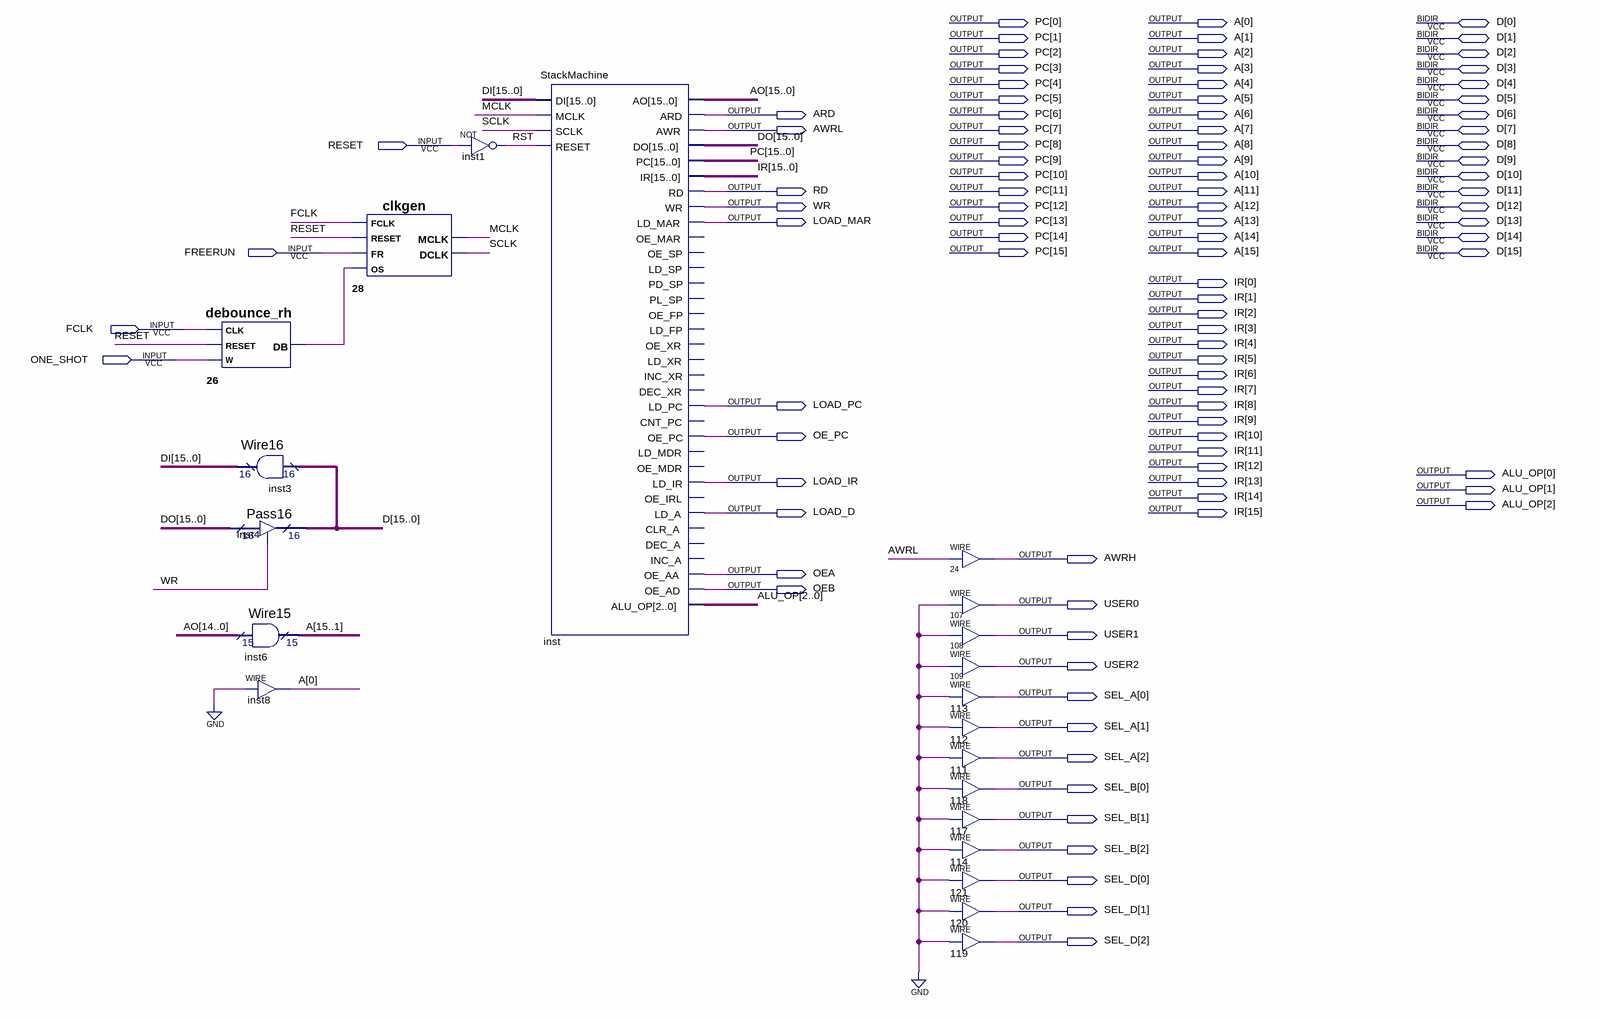
[diagram p0: schematic sheet]
// Quartus schematic StackMachine_hw.bdf as structural Verilog: 21 symbols, 95 pins
module StackMachine_hw (
  input  RESET,
  input  FREERUN,
  input  FCLK,
  input  ONE_SHOT,
  inout  [15:0] D,
  output [15:0] PC,
  output [15:0] A,
  output ARD,
  output AWRL,
  output RD,
  output WR,
  output LOAD_MAR,
  output [15:0] IR,
  output LOAD_PC,
  output OE_PC,
  output [2:0] ALU_OP,
  output LOAD_IR,
  output LOAD_D,
  output AWRH,
  output OEA,
  output OEB,
  output USER0,
  output USER1,
  output USER2,
  output [2:0] SEL_A,
  output [2:0] SEL_B,
  output [2:0] SEL_D
);

  wire MCLK, n26_db, RST, SCLK;
  wire [15:0] AO, DI, DO;

  debounce_rh u_26 (.CLK(FCLK), .RESET(RESET), .W(ONE_SHOT), .DB(n26_db));
  Wire16 inst3 (.data0x(D), .result(DI));
  Pass16 inst4 (.enabledt(WR), .data(DO), .tridata(D));
  Wire15 inst6 (.data0x(AO[14:0]), .result(A[15:1]));
  assign A[0] = 1'b0;  // WIRE inst8
  clkgen u_28 (.FCLK(FCLK), .RESET(RESET), .FR(FREERUN), .OS(n26_db), .MCLK(MCLK), .DCLK(SCLK));
  not inst1 (RST, RESET);
  StackMachine inst (
    .DI(DI), .MCLK(MCLK), .SCLK(SCLK), .RESET(RST), .AO(AO), .ARD(ARD), .AWR(AWRL), .DO(DO), .PC(PC),
    .IR(IR), .RD(RD), .WR(WR), .LD_MAR(LOAD_MAR), .LD_PC(LOAD_PC), .OE_PC(OE_PC), .LD_IR(LOAD_IR),
    .LD_A(LOAD_D), .OE_AA(OEA), .OE_AD(OEB), .ALU_OP(ALU_OP));  // open: OE_MAR, OE_SP, LD_SP, PD_SP, PL_SP, OE_FP, LD_FP, OE_XR, LD_XR, INC_XR, DEC_XR, CNT_PC, LD_MDR, OE_MDR, OE_IRL, CLR_A, DEC_A, INC_A
  assign AWRH = AWRL;  // WIRE 24
  assign USER0 = 1'b0;  // WIRE 107
  assign USER1 = 1'b0;  // WIRE 108
  assign USER2 = 1'b0;  // WIRE 109
  assign SEL_A[0] = 1'b0;  // WIRE 113
  assign SEL_A[1] = 1'b0;  // WIRE 112
  assign SEL_A[2] = 1'b0;  // WIRE 111
  assign SEL_B[0] = 1'b0;  // WIRE 118
  assign SEL_B[1] = 1'b0;  // WIRE 117
  assign SEL_B[2] = 1'b0;  // WIRE 114
  assign SEL_D[0] = 1'b0;  // WIRE 121
  assign SEL_D[1] = 1'b0;  // WIRE 120
  assign SEL_D[2] = 1'b0;  // WIRE 119
endmodule
